# EAGLE schematic xylo5-C_physical (EAGLE 7.3.0)
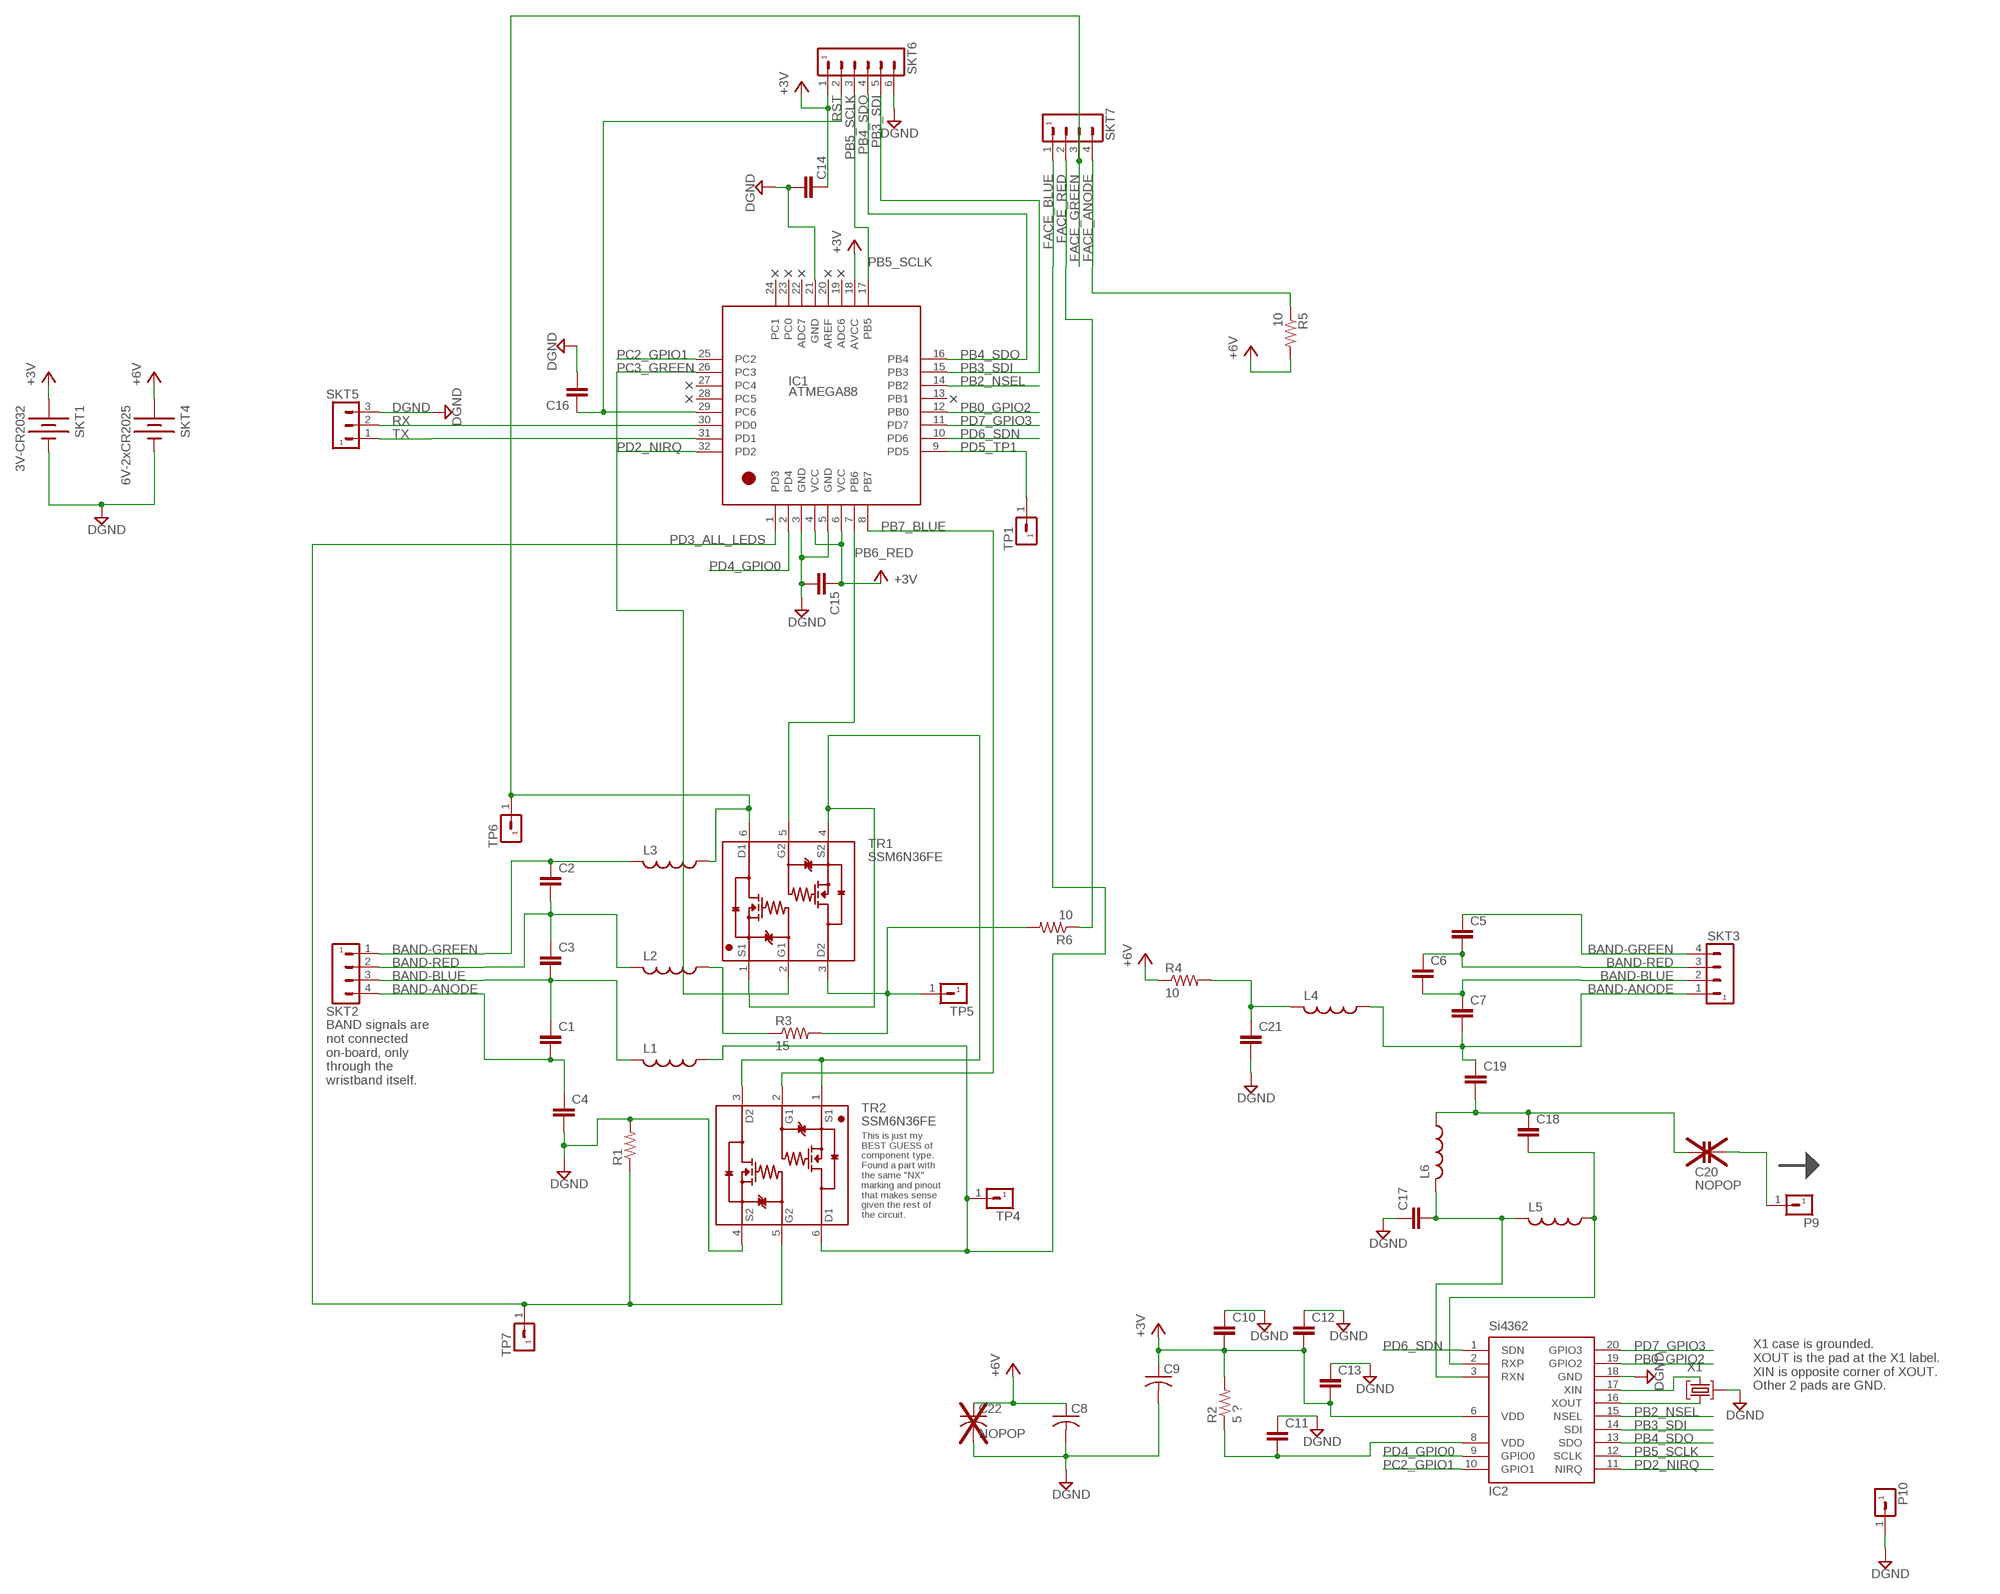
[diagram p0: schematic, sheet 1]

## Parts
C1  C-EU025-024X044  [C025-024X044]
C2  C-EU025-024X044  [C025-024X044]
C3  C-EU025-024X044  [C025-024X044]
C4  C-EU025-024X044  [C025-024X044]
C5  C-EU025-024X044  [C025-024X044]
C6  C-EU025-024X044  [C025-024X044]
C7  C-EU025-024X044  [C025-024X044]
C8  C-US025-024X044  [C025-024X044]
C9  C-US025-024X044  [C025-024X044]
C10  C-EU025-024X044  [C025-024X044]
C11  C-EU025-024X044  [C025-024X044]
C12  C-EU025-024X044  [C025-024X044]
C13  C-EU025-024X044  [C025-024X044]
C14  C-EU025-024X044  [C025-024X044]
C15  C-EU025-024X044  [C025-024X044]
C16  C-EU025-024X044  [C025-024X044]
C17  C-EU025-024X044  [C025-024X044]
C18  C-EU025-024X044  [C025-024X044]
C19  C-EU025-024X044  [C025-024X044]
C20  NOPOP  C-EU025-024X044  [C025-024X044]
C21  C-EU025-024X044  [C025-024X044]
C22  NOPOP  C-US025-024X044  [C025-024X044]
IC1  ATMEGA88  [DUMMY]
IC2  Si4362  SI4362  [DUMMY]
L1  L-USL2012C  [L2012C]
L2  L-USL2012C  [L2012C]
L3  L-USL2012C  [L2012C]
L4  L-USL2012C  [L2012C]
L5  L-USL2012C  [L2012C]
L6  L-USL2012C  [L2012C]
P9  MA01-1  [MA01-1]
P10  MA01-1  [MA01-1]
R1  R-US_R0603  [R0603]
R2  5 ?  R-US_R0603  [R0603]
R3  15  R-US_R0603  [R0603]
R4  10  R-US_R0603  [R0603]
R5  10  R-US_R0603  [R0603]
R6  10  R-US_R0603  [R0603]
SKT1  3V-CR2032  BATTERYFOB  [BATTERY_20MM_PTH_COMPACT]
SKT2  MA04-1  [MA04-1]
SKT3  MA04-1  [MA04-1]
SKT4  6V-2xCR2025  BATTERYFOB  [BATTERY_20MM_PTH_COMPACT]
SKT5  MA03-1  [MA03-1]
SKT6  MA06-1  [MA06-1]
SKT7  MA04-1  [MA04-1]
TP1  MA01-1  [MA01-1]
TP4  MA01-1  [MA01-1]
TP5  MA01-1  [MA01-1]
TP6  MA01-1  [MA01-1]
TP7  MA01-1  [MA01-1]
TR1  SSM6N36FE  [DUMMY]
TR2  SSM6N36FE  [DUMMY]
X1  8M10AHC49T  [HC49U]

## Nets
BAND-ANODE: C1.2 C4.1 C7.2 C19.1 L4.1 SKT2.4 SKT3.1
BAND-BLUE: C1.1 C3.2 C6.2 C7.1 L1.2 SKT2.3 SKT3.2
BAND-GREEN: C2.1 C5.1 L3.2 SKT2.1 SKT3.4
BAND-RED: C2.2 C3.1 C5.2 C6.1 L2.2 SKT2.2 SKT3.3
DGND: C4.2 C8.2 C9.2 C10.1 C11.1 C12.1 C13.1 C14.2 C15.2 C16.2 C17.1 C21.2 C22.2 IC1.3(GND) IC1.5(GND) IC1.21(GND) IC2.18(GND) P10.1 R1.2 SKT1.2(-) SKT4.2(-) SKT5.3 SKT6.6 TR2.4(S2) X1.2
FACE_ANODE: R5.1 SKT7.4
FACE_BLUE: L1.1 SKT7.1 TP4.1 TR2.6(D1)
FACE_GREEN: L3.1 SKT7.3 TP6.1 TR1.6(D1)
FACE_RED: R6.1 SKT7.2
N$2: C21.1 L4.2 R4.2
N$3: IC2.16(XOUT) X1.1
N$4: IC2.17(XIN) X1.3
N$5: C11.2 IC2.8(VDD) R2.1
N$6: C18.1 C19.2 C20.1 L6.1
N$7: C18.2 IC2.2(RXP) L5.1
N$8: C17.2 IC2.3(RXN) L5.2 L6.2
N$10: C20.2 P9.1
N$12: TR1.1(S1) TR1.4(S2) TR2.1(S1) TR2.3(D2)
N$15: L2.1 R3.1
N$16: R3.2 R6.2 TP5.1 TR1.3(D2)
PB0_GPIO2: IC1.12(PB0) IC2.19(GPIO2)
PB2_NSEL: IC1.14(PB2) IC2.15(NSEL)
PB3_SDI: IC1.15(PB3) IC2.14(SDI) SKT6.5
PB4_SDO: IC1.16(PB4) IC2.13(SDO) SKT6.4
PB5_SCLK: IC1.17(PB5) IC2.12(SCLK) SKT6.3
PB6_RED: IC1.7(PB6) TR1.5(G2)
PB7_BLUE: IC1.8(PB7) TR2.2(G1)
PC2_GPIO1: IC1.25(PC2) IC2.10(GPIO1)
PC3_GREEN: IC1.26(PC3) TR1.2(G1)
PD2_NIRQ: IC1.32(PD2) IC2.11(NIRQ)
PD3_ALL_LEDS: IC1.1(PD3) R1.1 TP7.1 TR2.5(G2)
PD4_GPIO0: IC1.2(PD4) IC2.9(GPIO0)
PD5_TP1: IC1.9(PD5) TP1.1
PD6_SDN: IC2.1(SDN)
PD7_GPIO3: IC1.11(PD7) IC2.20(GPIO3)
RST: C16.1 IC1.29(PC6) SKT6.2
RX: IC1.30(PD0) SKT5.2
TX: IC1.31(PD1) SKT5.1
V1: C9.1 C10.2 C12.2 C13.2 C14.1 C15.1 IC1.4(VCC) IC1.6(VCC) IC1.18(AVCC) IC2.6(VDD) R2.2 SKT1.1(+) SKT6.1 ; supply symbol labelled +3V
V2: C8.1 C22.1 R4.1 R5.2 SKT4.1(+) ; supply symbol labelled +6V
Unconnected: IC1.10(PD6) IC1.13(PB1) IC1.19(ADC6) IC1.20(AREF) IC1.22(ADC7) IC1.23(PC0) IC1.24(PC1) IC1.27(PC4) IC1.28(PC5)

## Notes on the sheet
- BAND signals are
  not connected
  on-board, only
  through the
  wristband itself.
- This is just my
  BEST GUESS of
  component type.
  Found a part with
  the same "NX"
  marking and pinout
  that makes sense
  given the rest of
  the circuit.
- X1 case is grounded.
  XOUT is the pad at the X1 label.
  XIN is opposite corner of XOUT.
  Other 2 pads are GND.

## Library data of the parts
C1-C7 C10-C21 = rcl:C-EU: CAPACITOR, European symbol
C8 C9 C22 = Custom-Parts:C-US: CAPACITOR, American symbol
IC1 = Custom-Parts:ATMEGA88: Atmel ATMEGA88 No packages created (uses a dummy package)
IC2 = Custom-Parts:SI4362: Silicon Labs Si4362 No packages created (uses a dummy package)
L1-L6 = rcl:L-US: INDUCTOR, American symbol
P9 P10 TP1 TP4-TP7 = Custom-Parts:MA01-1
R1-R6 = Custom-Parts:R-US_: RESISTOR, American symbol
SKT1 SKT4 = SparkFun:BATTERY: Battery Holders Various common sizes : AA, AAA, 20mm coin cell and 12mm coin cell.
SKT2 SKT3 SKT7 = Custom-Parts:MA04-1
SKT5 = Custom-Parts:MA03-1: Male Header 0.040 drill
SKT6 = Custom-Parts:MA06-1
TR1 TR2 = Custom-Parts:SSM6N36FE: TOSHIBA Field-Effect Transistor Silicon N-Channel MOS Type SSM6N36FE Dual MOSFET 2 channel High-Speed Switching Applications Digi-Key: SSM6N36FELMCT-ND - MOSFET 2N-CH 20V 0.5A ES6 No packages created (uses a dummy package)
X1 = crystal:8M10AHC49T: Monolithic Crystal Filters Source: www.vanlong.com; OC_FARNELL: unknown; OC_NEWARK: unknown